# EAGLE design PCB (EAGLE 6.5.0)
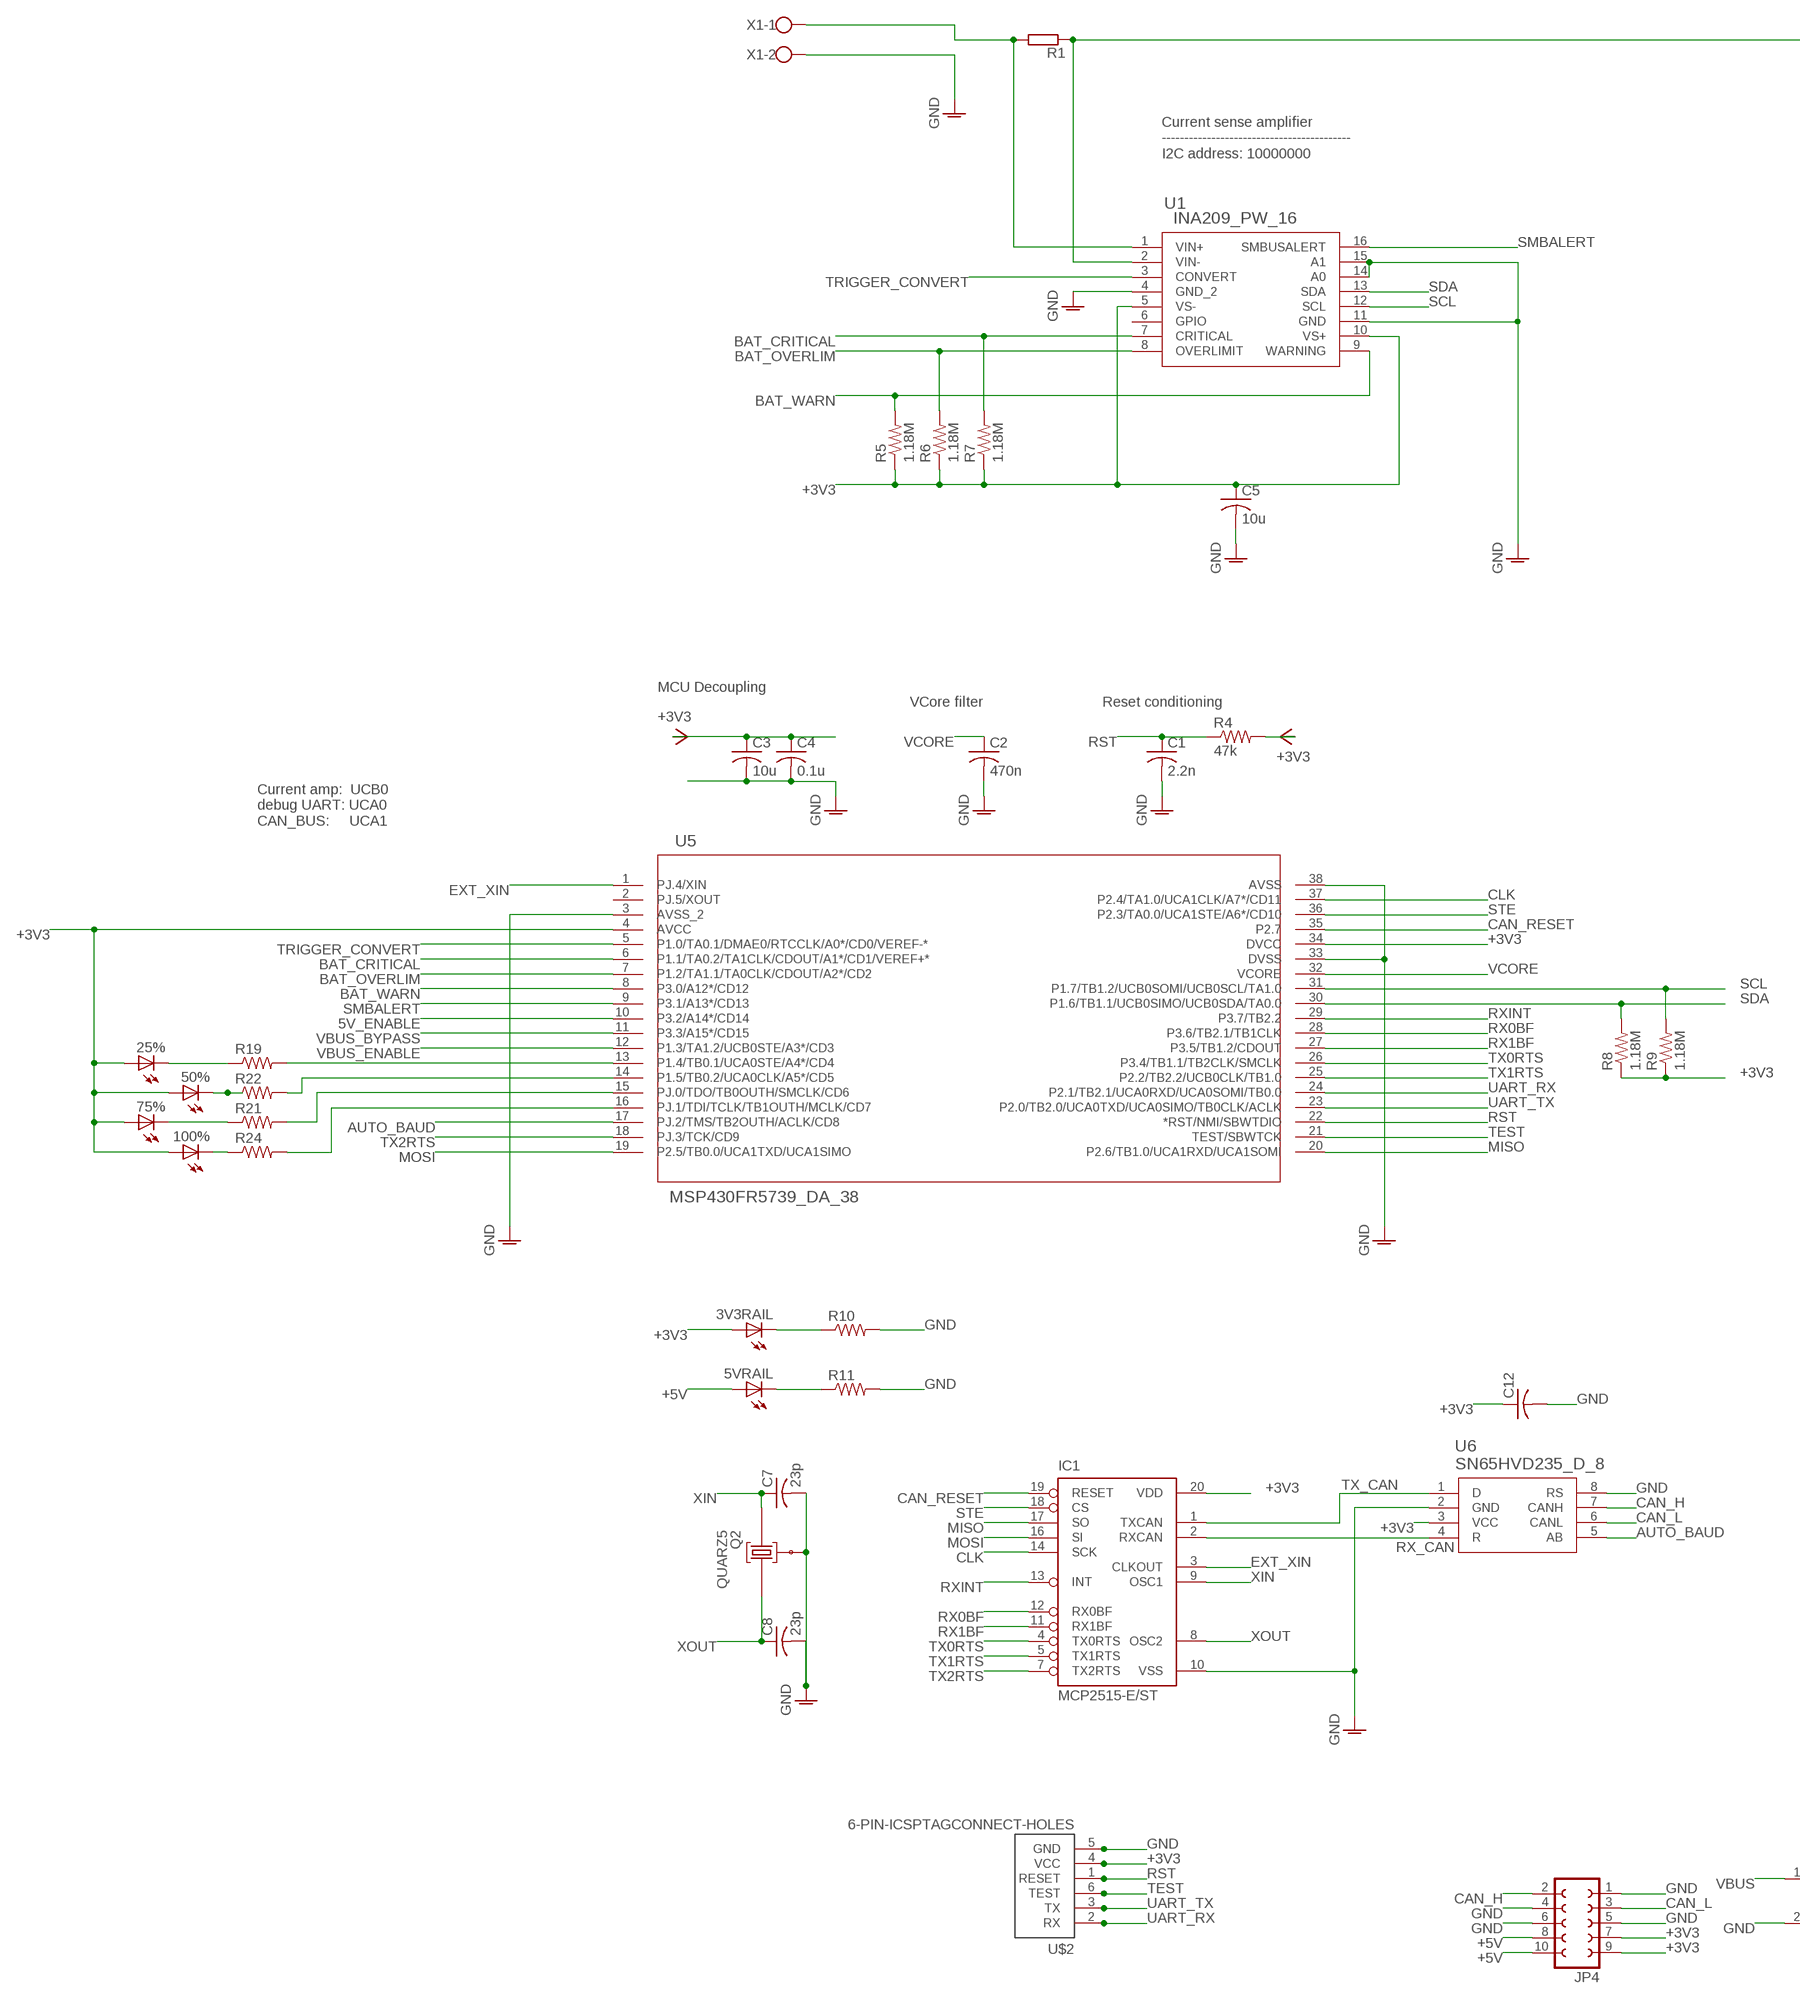
[diagram p0: schematic, sheet 1, part 1 of 2]
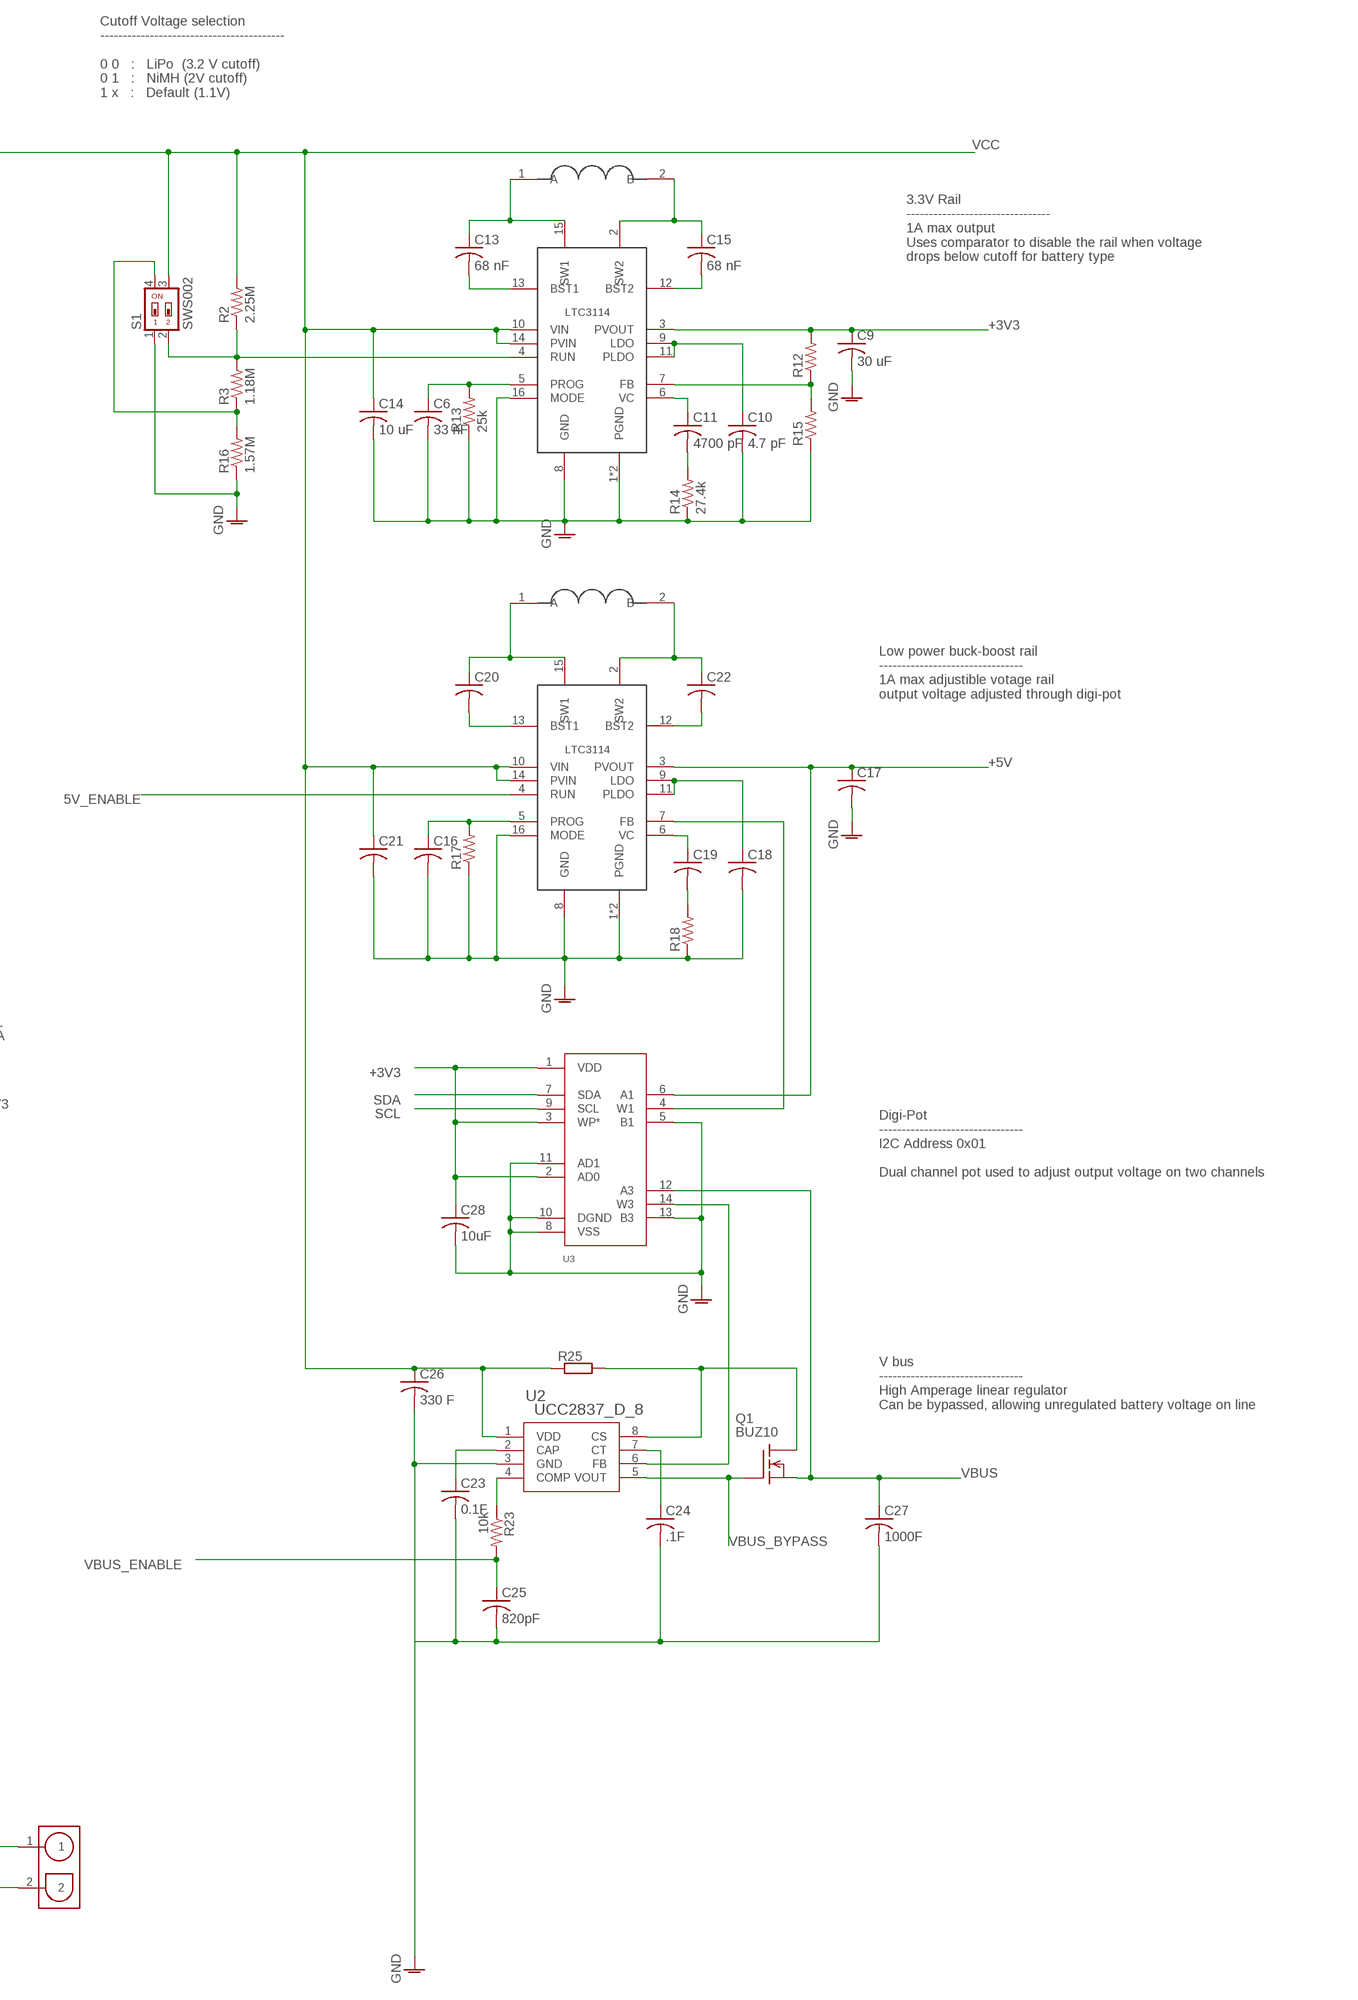
[diagram p1: schematic, sheet 1, part 2 of 2]

## Parts
3V3RAIL  LEDCHIP-LED0603  [CHIP-LED0603]
5VRAIL  LEDCHIP-LED0603  [CHIP-LED0603]
25%  LEDCHIP-LED0603  [CHIP-LED0603]
50%  LEDCHIP-LED0603  [CHIP-LED0603]
75%  LEDCHIP-LED0603  [CHIP-LED0603]
100%  LEDCHIP-LED0603  [CHIP-LED0603]
C1  2.2n  C-USC1206  [C1206]
C2  470n  C-USC1206  [C1206]
C3  10u  C-USC1206  [C1206]
C4  0.1u  C-USC1206  [C1206]
C5  10u  C-USC1206  [C1206]
C6  33 nF  C-USC0805  [C0805]
C7  23p  C-USC1206  [C1206]
C8  23p  C-USC1206  [C1206]
C9  30 uF  C-USC0805  [C0805]
C10  4.7 pF  C-USC0805  [C0805]
C11  4700 pF  C-USC0805  [C0805]
C12  C-USC0603  [C0603]
C13  68 nF  C-USC0805  [C0805]
C14  10 uF  C-USC0805  [C0805]
C15  68 nF  C-USC0805  [C0805]
C16  C-USC0805  [C0805]
C17  C-USC0805  [C0805]
C18  C-USC0805  [C0805]
C19  C-USC0805  [C0805]
C20  C-USC0805  [C0805]
C21  C-USC0805  [C0805]
C22  C-USC0805  [C0805]
C23  0.1F  C-USC0805  [C0805]
C24  .1F  C-USC0805  [C0805]
C25  820pF  C-USC0805  [C0805]
C26  330 F  C-USC0805  [C0805]
C27  1000F  C-USC0805  [C0805]
C28  10uF  C-USC0603  [C0603]
IC1  MCP2515-E/ST  [TSSOP20]
JP4  FE05-2  [FE05-2]
Q1  BUZ10  [TO220]
Q2  QUARZ5  [QUARZ5]
R1  SMR  [SMR]
R2  2.25M  R-US_R0805  [R0805]
R3  1.18M  R-US_R0805  [R0805]
R4  47k  R-US_R1206  [R1206]
R5  1.18M  R-US_R0805  [R0805]
R6  1.18M  R-US_R0805  [R0805]
R7  1.18M  R-US_R0805  [R0805]
R8  1.18M  R-US_R0805  [R0805]
R9  1.18M  R-US_R0805  [R0805]
R10  R-US_R0603  [R0603]
R11  R-US_R0603  [R0603]
R12  R-US_M0805  [M0805]
R13  25k  R-US_M0805  [M0805]
R14  27.4k  R-US_M0805  [M0805]
R15  R-US_M0805  [M0805]
R16  1.57M  R-US_R0805  [R0805]
R17  R-US_M0805  [M0805]
R18  R-US_M0805  [M0805]
R19  R-US_R0603  [R0603]
R21  R-US_R0603  [R0603]
R22  R-US_R0603  [R0603]
R23  10k  R-US_M0805  [M0805]
R24  R-US_R0603  [R0603]
R25  SMR  [SMR]
S1  SWS002  [SMS-002]
U1  INA209_PW_16  [PW16]
U2  UCC2837_D_8  [D8]
U3  AD5252BRU10  [RU_14]
U5  MSP430FR5739_DA_38  [DA38]
U6  SN65HVD235_D_8  [D8]
U$1  LTC3114  [TSSOP-16]
U$2  6-PIN-ICSPTAGCONNECT-HOLES  [TAGCONNECT-HOLES]
U$3  LTC3114  [TSSOP-16]
U$4  DC630R-562M  [DC630]
U$5  DC630R-562M  [DC630]
U$6  MOLEX_15-31-1026  [MOLEX-15-31-1026]
X1  W237-102  [W237-102]

## Nets
5V_ENABLE: U5.10(P3.2/A14*/CD14) U$3.4(RUN)
+3V3: 3V3RAIL.A 25%.A 50%.A 75%.A 100%.A C3.1 C4.1 C5.1 C9.1 C12.1 C28.1 IC1.20(VDD) JP4.7 JP4.9 R4.2 R5.1 R6.1 R7.1 R8.1 R9.1 R12.2 U1.5(VS-) U1.10(VS+) U3.1(VDD) U3.2(AD0) U3.3(WP*) U5.4(AVCC) U5.34(DVCC) U6.3(VCC) U$1.3(PVOUT) U$2.4(VCC)
+5V: 5VRAIL.A C17.1 JP4.8 JP4.10 U3.6(A1) U$3.3(PVOUT)
AUTO_BAUD: U5.17(PJ.2/TMS/TB2OUTH/ACLK/CD8) U6.5(AB)
BAT_CRITICAL: R7.2 U1.7(CRITICAL) U5.6(P1.1/TA0.2/TA1CLK/CDOUT/A1*/CD1/VEREF+*)
BAT_OVERLIM: R6.2 U1.8(OVERLIMIT) U5.7(P1.2/TA1.1/TA0CLK/CDOUT/A2*/CD2)
BAT_WARN: R5.2 U1.9(WARNING) U5.8(P3.0/A12*/CD12)
CAN_H: JP4.2 U6.7(CANH)
CAN_L: JP4.3 U6.6(CANL)
CAN_RESET: IC1.19(RESET) U5.35(P2.7)
CLK: IC1.14(SCK) U5.37(P2.4/TA1.0/UCA1CLK/A7*/CD11)
EXT_XIN: IC1.3(CLKOUT) U5.1(PJ.4/XIN)
GND: C1.2 C2.2 C3.2 C4.2 C5.2 C6.2 C7.2 C8.2 C10.2 C12.2 C14.2 C16.2 C17.2 C18.2 C21.2 C23.2 C24.2 C25.2 C26.2 C27.2 C28.2 IC1.10(VSS) JP4.1 JP4.4 JP4.5 JP4.6 Q2.GND@0 R10.2 R11.2 R13.1 R14.1 R15.1 R16.1 R17.1 R18.1 S1.1 U1.4(GND_2) U1.11(GND) U1.14(A0) U1.15(A1) U2.3(GND) U3.5(B1) U3.8(VSS) U3.10(DGND) U3.11(AD1) U3.13(B3) U5.3(AVSS_2) U6.2(GND) U6.8(RS) U$1.1(PGND) U$1.8(GND) U$1.16(MODE) U$1.PAD(PGND) U$2.5(GND) U$3.1(PGND) U$3.8(GND) U$3.16(MODE) U$3.PAD(PGND) U$6.2 X1.2
GNDA: C9.2 U5.33(DVSS) U5.38(AVSS) ; supply symbol labelled GND
MISO: IC1.17(SO) U5.20(P2.6/TB1.0/UCA1RXD/UCA1SOMI)
MOSI: IC1.16(SI) U5.19(P2.5/TB0.0/UCA1TXD/UCA1SIMO)
N$1: 25%.C R19.1
N$2: R3.1 R16.2 S1.4
N$3: R19.2 U5.13(P1.4/TB0.1/UCA0STE/A4*/CD4)
N$4: 5VRAIL.C R11.1
N$5: 3V3RAIL.C R10.1
N$6: C13.1 U$1.15(SW1) U$4.1(A)
N$7: C15.1 U$1.2(SW2) U$4.2(B)
N$8: C13.2 U$1.13(BST1)
N$9: C15.2 U$1.12(BST2)
N$10: C20.1 U$3.15(SW1) U$5.1(A)
N$11: C6.1 R13.2 U$1.5(PROG)
N$12: C22.1 U$3.2(SW2) U$5.2(B)
N$13: C10.1 U$1.9(LDO) U$1.11(PLDO)
N$14: C20.2 U$3.13(BST1)
N$15: C11.1 U$1.6(VC)
N$16: C11.2 R14.2
N$17: R12.1 R15.2 U$1.7(FB)
N$18: C22.2 U$3.12(BST2)
N$19: C16.1 R17.2 U$3.5(PROG)
N$20: C18.1 U$3.9(LDO) U$3.11(PLDO)
N$21: R2.1 R3.2 S1.2 U$1.4(RUN)
N$22: C19.1 U$3.6(VC)
N$23: C19.2 R18.2
N$24: U3.4(W1) U$3.7(FB)
N$25: Q1.2(D) R25.1 U2.8(CS)
N$26: R22.2 U5.14(P1.5/TB0.2/UCA0CLK/A5*/CD5)
N$27: C23.1 U2.2(CAP)
N$28: U2.6(FB) U3.14(W3)
N$29: R23.1 U2.4(COMP)
N$30: R21.2 U5.15(PJ.0/TDO/TB0OUTH/SMCLK/CD6)
N$31: R24.2 U5.16(PJ.1/TDI/TCLK/TB1OUTH/MCLK/CD7)
N$32: C24.1 U2.7(CT)
N$33: 50%.C R22.1
N$34: 75%.C R21.1
N$35: 100%.C R24.1
RST: C1.1 R4.1 U5.22(*RST/NMI/SBWTDIO) U$2.1(RESET)
RX0BF: IC1.12(RX0BF) U5.28(P3.6/TB2.1/TB1CLK)
RX1BF: IC1.11(RX1BF) U5.27(P3.5/TB1.2/CDOUT)
RX_CAN: IC1.2(RXCAN) U6.4(R)
RXINT: IC1.13(INT) U5.29(P3.7/TB2.2)
SCL: R9.2 U1.12(SCL) U3.9(SCL) U5.31(P1.7/TB1.2/UCB0SOMI/UCB0SCL/TA1.0)
SDA: R8.2 U1.13(SDA) U3.7(SDA) U5.30(P1.6/TB1.1/UCB0SIMO/UCB0SDA/TA0.0)
SMBALERT: U1.16(SMBUSALERT) U5.9(P3.1/A13*/CD13)
STE: IC1.18(CS) U5.36(P2.3/TA0.0/UCA1STE/A6*/CD10)
TEST: U5.21(TEST/SBWTCK) U$2.6(TEST)
TRIGGER_CONVERT: U1.3(CONVERT) U5.5(P1.0/TA0.1/DMAE0/RTCCLK/A0*/CD0/VEREF-*)
TX0RTS: IC1.4(TX0RTS) U5.26(P3.4/TB1.1/TB2CLK/SMCLK)
TX1RTS: IC1.5(TX1RTS) U5.25(P2.2/TB2.2/UCB0CLK/TB1.0)
TX2RTS: IC1.7(TX2RTS) U5.18(PJ.3/TCK/CD9)
TX_CAN: IC1.1(TXCAN) U6.1(D)
UART_RX: U5.24(P2.1/TB2.1/UCA0RXD/UCA0SOMI/TB0.0) U$2.2(RX)
UART_TX: U5.23(P2.0/TB2.0/UCA0TXD/UCA0SIMO/TB0CLK/ACLK) U$2.3(TX)
VBUS: C27.1 Q1.3(S) U3.12(A3) U$6.1
VBUS_BYPASS: Q1.1(G) U2.5(VOUT) U5.11(P3.3/A15*/CD15)
VBUS_ENABLE: C25.1 R23.2 U5.12(P1.3/TA1.2/UCB0STE/A3*/CD3)
VCC: C14.1 C21.1 C26.1 R1.2 R2.2 R25.2 S1.3 U1.2(VIN-) U2.1(VDD) U$1.10(VIN) U$1.14(PVIN) U$3.10(VIN) U$3.14(PVIN)
VCC_1: R1.1 U1.1(VIN+) X1.1
VCORE: C2.1 U5.32(VCORE)
XIN: C7.1 IC1.9(OSC1) Q2.2
XOUT: C8.1 IC1.8(OSC2) Q2.1
Unconnected: U1.6(GPIO) U5.2(PJ.5/XOUT)

## Notes on the sheet
- Cutoff Voltage selection
  -----------------------------------------
  
  0 0   :   LiPo  (3.2 V cutoff)
  0 1   :   NiMH (2V cutoff)
  1 x   :   Default (1.1V)
- Current sense amplifier
  ------------------------------------------
  I2C address: 10000000
- 3.3V Rail
  --------------------------------
  1A max output
  Uses comparator to disable the rail when voltage
  drops below cutoff for battery type
- Low power buck-boost rail
  --------------------------------
  1A max adjustible votage rail
  output voltage adjusted through digi-pot
- MCU Decoupling
- VCore filter | Reset conditioning
- Current amp:  UCB0
  debug UART: UCA0
  CAN_BUS:     UCA1
- Digi-Pot
  --------------------------------
  I2C Address 0x01
  
  Dual channel pot used to adjust output voltage on two channels
- V bus
  --------------------------------
  High Amperage linear regulator
  Can be bypassed, allowing unregulated battery voltage on line

## Library data of the parts
3V3RAIL 5VRAIL 25% 50% 75% 100% = adafruit:LED: LED OSRAM: - CHIPLED LG R971, LG N971, LY N971, LG Q971, LY Q971, LO R971, LY R971 LH N974, LH R974 LS Q976, LO Q976, LY Q976 LO Q996 - Hyper CHIPLED LW Q18S LB Q993, LB Q99A, LB R99A - SideLED LS A670, LO A670, LY A670, LG A670, LP A670 LB A673, LV A673, LT A673, LW A673 LH A674 LY A675 LS A676, LA A676, LO A676, LY A676, LW A676 LS A679, LY A679, LG A679 - Hyper Micro SIDELED® LS Y876, LA Y876, LO Y876, LY Y876 LT Y87S - SmartLED LW L88C, LW L88S LB L89C, LB L89S, LG L890 LS L89K, LO L89K, LY L89K LS L896, LA L896, LO L896, LY L896 - TOPLED LS T670, LO T670, LY T670, LG T670, LP T670 LSG T670, LSP T670, LSY T670, LOP T670, LYG T670 LG T671, LOG T671, LSG T671 LB T673, LV T673, LT T673, LW T673 LH T674 LS T676, LA T676, LO T676, LY T676, LB T676, LH T676, LSB T676, LW T676 LB T67C, LV T67C, LT T67C, LS T67K, LO T67K, LY T67K, LW E67C LS E67B, LA E67B, LO E67B, LY E67B, LB E67C, LV E67C, LT E67C LW T67C LS T679, LY T679, LG T679 LS T770, LO T770, LY T770, LG T770, LP T770 LB T773, LV T773, LT T773, LW T773 LH T774 LS E675, LA E675, LY E675, LS T675 LS T776, LA T776, LO T776, LY T776, LB T776 LHGB T686 LT T68C, LB T68C - Hyper Mini TOPLED® LB M676 - Mini TOPLED Santana® LG M470 LS M47K, LO M47K, LY M47K Source: http://www.osram.convergy.de/
C1-C28 = adafruit:C-US: CAPACITOR, American symbol
IC1 = mcp2515:MCP2515
JP4 = con-lsta:FE05-2: FEMALE HEADER; OC_FARNELL: unknown; OC_NEWARK: unknown
Q1 = transistor-fet:BUZ10: N-Channel Enhancement MOSFET 50V; 20A; 0,080Ohm
Q2 = sMSP430:QUARZ5
R1 R25 = resistor-shunt:SMR: SMD SHUNT RESISTOR; OC_FARNELL: unknown; OC_NEWARK: unknown
R2-R19 R21-R24 = adafruit:R-US_: RESISTOR, American symbol
S1 = smd-special:SWS002: SMD Dip Switch 2 pol.
U1 = TexasInstruments:INA209_PW_16; DATASHEETURL: http://www.ti.com/lit/gpn/INA209; DESCRIPTION: High-Side Measurement, Bi-Directional Current/Power Monitor with I2C Interface; FAMILY_NAME: CURRENT SHUNT MONITOR; GENERIC_PART_NUMBER: INA209; INDUSTRY_STD_PKG_TYPE: TSSOP; MANUFACTURER: Texas Instruments; MANUFACTURER_PART_NUMBER: ina209_pw_16; PACKAGE_DESIGNATOR: PW; PIN_COUNT: 16; VENDOR: Texas Instruments
U2 = TexasInstruments:UCC2837_D_8; DATASHEETURL: http://www.ti.com/lit/gpn/UCC2837; DESCRIPTION: 8-Pin N-FET Linear Regulator Controller; FAMILY_NAME: LDO CONTROLLER; GENERIC_PART_NUMBER: UCC2837; INDUSTRY_STD_PKG_TYPE: SOIC; MANUFACTURER: Texas Instruments; MANUFACTURER_PART_NUMBER: ucc2837_d_8; PACKAGE_DESIGNATOR: D; PIN_COUNT: 8; VENDOR: Texas Instruments
U3 = linear:AD5252BRU10; MANUFACTURER_PART_NUMBER: AD5252BRU10; VENDOR: Vendor
U5 = TexasInstruments:MSP430FR5739_DA_38; DATASHEETURL: http://www.ti.com/lit/gpn/MSP430FR5739; DESCRIPTION: MSP430FR573x,MSP430FR572x Mixed Signal Microcontroller; FAMILY_NAME: FRAM Series; GENERIC_PART_NUMBER: MSP430FR5739; INDUSTRY_STD_PKG_TYPE: TSSOP; MANUFACTURER: Texas Instruments; MANUFACTURER_PART_NUMBER: msp430fr5739_da_38; PACKAGE_DESIGNATOR: DA; PIN_COUNT: 38; VENDOR: Texas Instruments
U6 = TexasInstruments:SN65HVD235_D_8; DATASHEETURL: http://www.ti.com/lit/gpn/SN65HVD235; DESCRIPTION: 3.3V CAN with Standby Mode, Autobaud Loop-back; FAMILY_NAME: CAN; GENERIC_PART_NUMBER: SN65HVD235; INDUSTRY_STD_PKG_TYPE: SOIC; MANUFACTURER: Texas Instruments; MANUFACTURER_PART_NUMBER: sn65hvd235_d_8; PACKAGE_DESIGNATOR: D; PIN_COUNT: 8; VENDOR: Texas Instruments
U$1 U$3 = linear:LTC3114
U$2 = LaunchFET:6-PIN-ICSP: 6 pin easy-msp formatted headers. Designed to make programming target boards with MSP430 Launchpad easier. EASYMSP: standard .05" pitch header to match launchpad SAFEMSP: .05" header with .025" offset Vcc to keep Geordi away
U$4 U$5 = connectors:DC630R-562M
U$6 = connectors:MOLEX_15-31-1026
X1 = con-wago-500:W237-102: WAGO SCREW CLAMP; MPN: 237-102; OC_FARNELL: unknown; OC_NEWARK: 70K9898

## Board
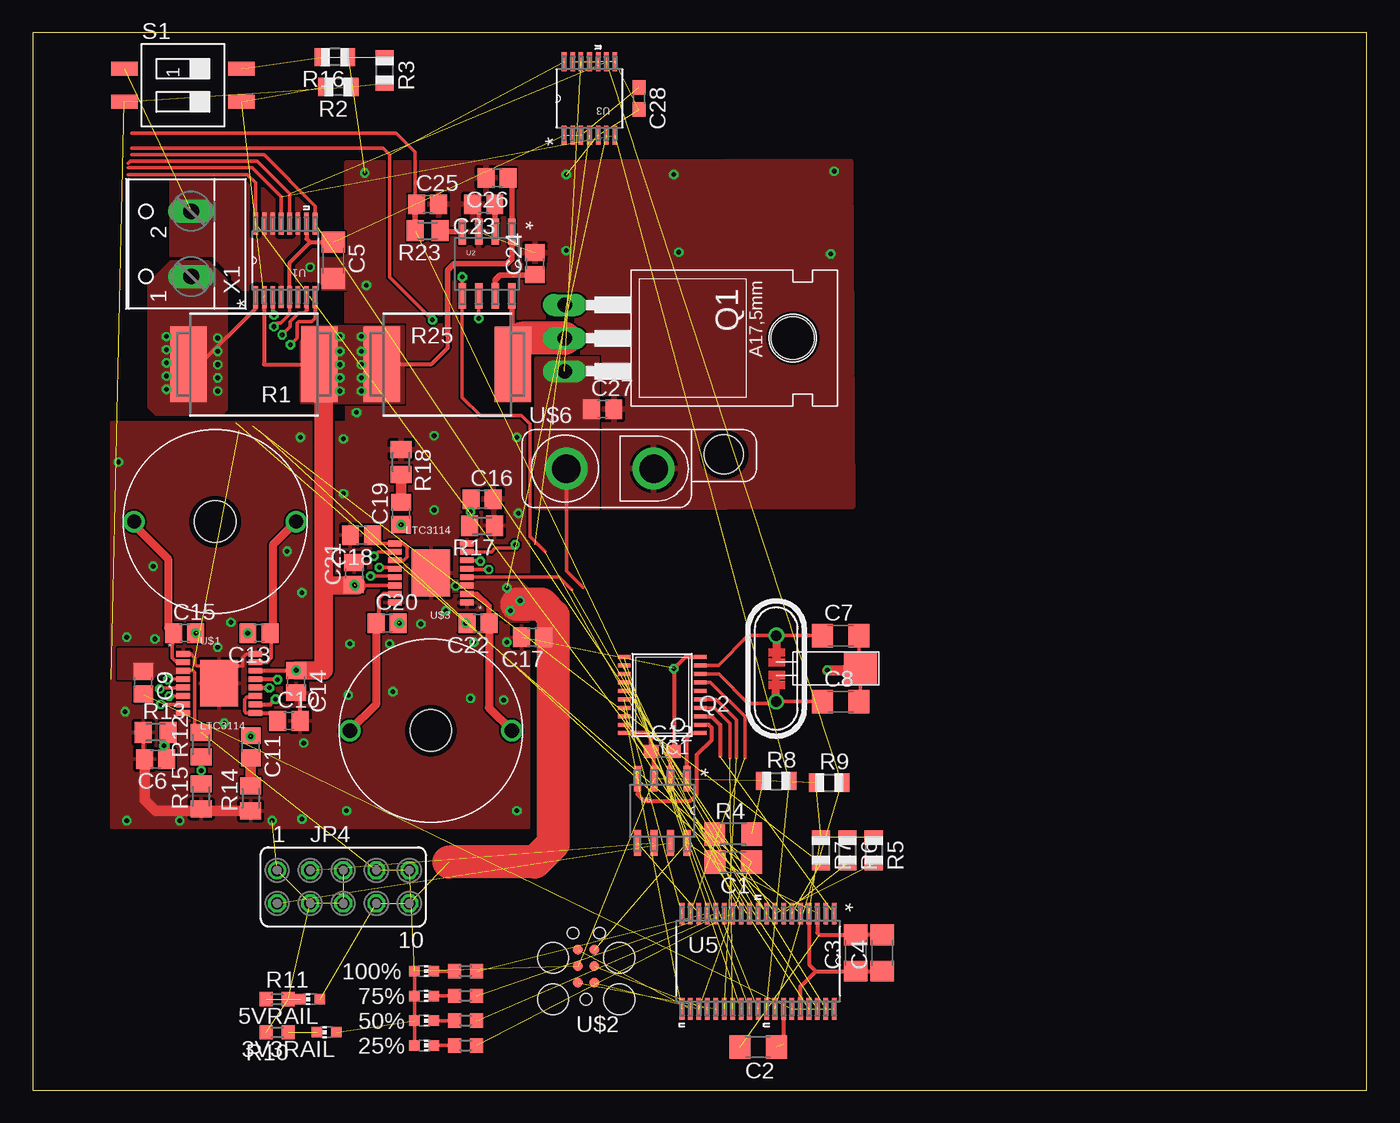
[diagram p2: board, top side]
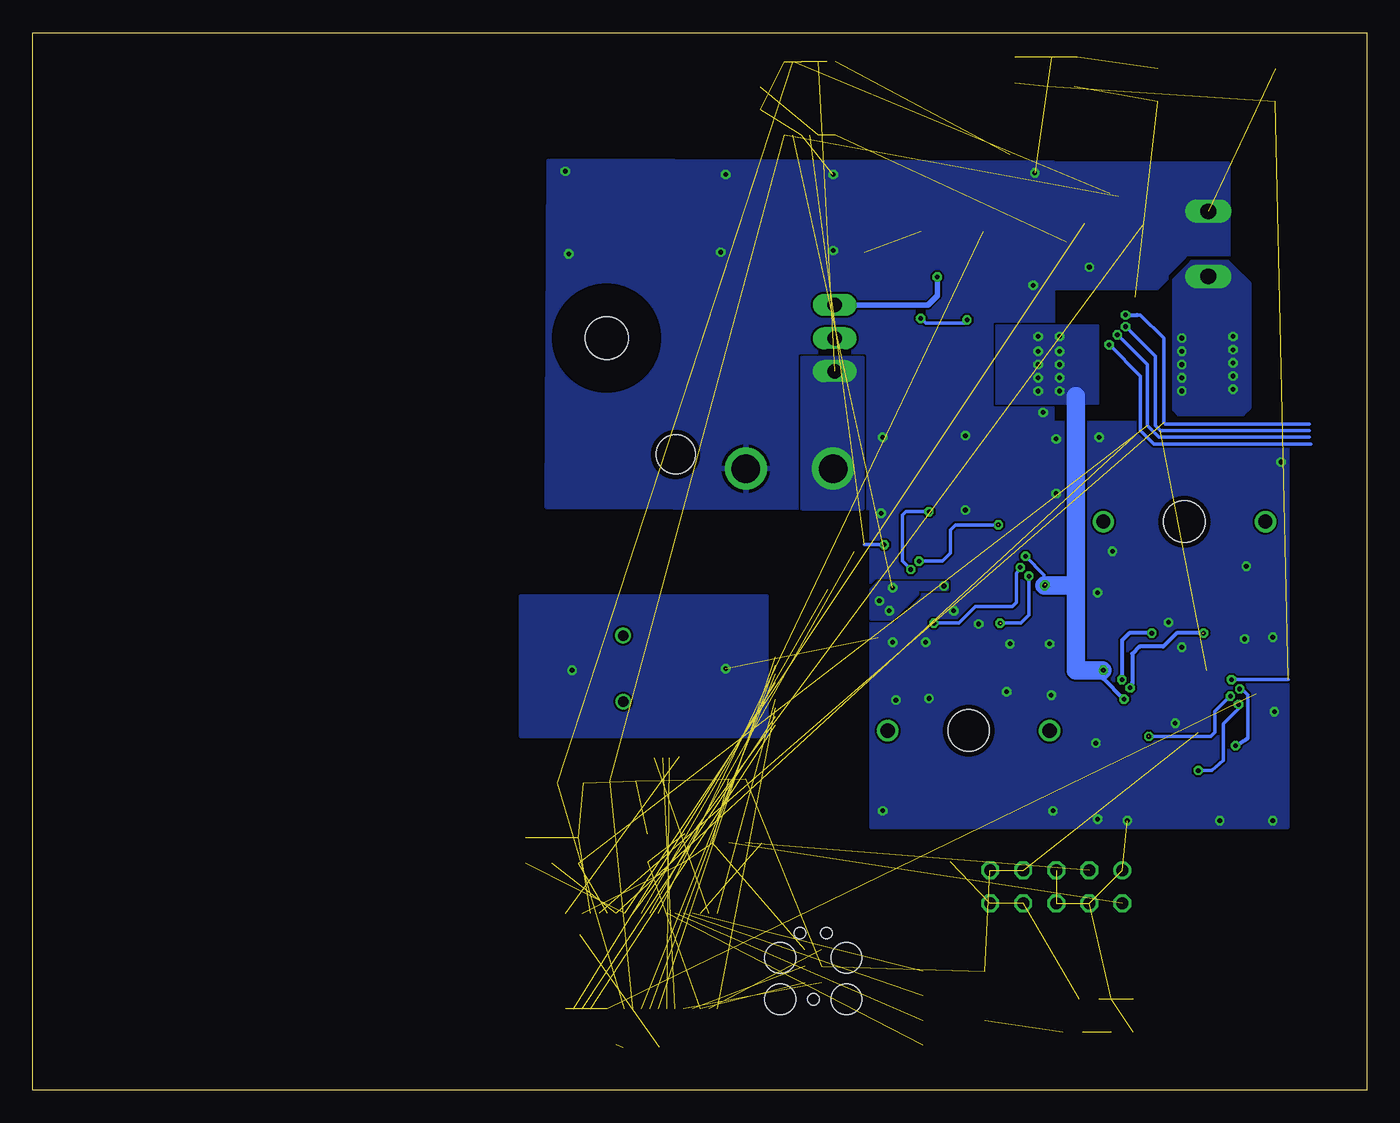
[diagram p3: board, bottom side, seen from below]

Size 102.54 x 81.27 mm. Coordinates in mm from the lower left corner, seen from the top.
Outline: 0,0 102.54,0 102.54,81.27 0,81.27 0,0
Copper layers (1*16): Top 0.0356mm / dielectric 1.5011mm / Bottom 0.0356mm
Design rules "oshpark": minimum track width 6mil, minimum drill 13mil, track to track 6mil, track to pad 6mil, pad to pad 6mil, via to via 6mil, smd to smd 6mil, copper to edge 15mil, drill to drill 6mil, minimum pad ring 7mil, minimum via ring 7mil, stop-mask expansion 4mil, vias tented up to drill 0mil, thermal gap 10mil

### Footprints (pad centres in the part's own frame; a part is rotated, then mirrored left to right if it is on the bottom)
CHIP-LED0603 = smd 0.8 x 0.8: A 0,-0.75; C 0,0.75
C1206 = smd 1.6 x 1.8: 1 -1.4,0; 2 1.4,0
C0805 = smd 1.3 x 1.5: 1 -0.85,0; 2 0.85,0
C0603 = smd 1.1 x 1: 1 -0.85,0; 2 0.85,0
TSSOP20 = smd 0.305 x 0.991: 1 -2.925,-2.918; 2 -2.275,-2.918; 3 -1.625,-2.918; 4 -0.975,-2.918; 5 -0.325,-2.918; 6 0.325,-2.918; 7 0.975,-2.918; 8 1.625,-2.918; 9 2.275,-2.918; 10 2.925,-2.918; 11 2.925,2.918; 12 2.275,2.918; 13 1.625,2.918; 14 0.975,2.918; 15 0.325,2.918; 16 -0.325,2.918; 17 -0.975,2.918; 18 -1.625,2.918; 19 -2.275,2.918; 20 -2.925,2.918
FE05-2 = drill 0.914: 1 -5.08,1.27 | drill 0.914 octagon: 2 -5.08,-1.27; 3 -2.54,1.27; 4 -2.54,-1.27; 5 0,1.27; 6 0,-1.27; 7 2.54,1.27; 8 2.54,-1.27; 9 5.08,1.27; 10 5.08,-1.27
TO220 = drill 1.118 long: 1 -2.54,-6.35; 2 0,-6.35; 3 2.54,-6.35 | hole 3.302: 0,11.176
QUARZ5 = drill 0.813: 1 1.53,1.773; 2 1.52,-3.303 | smd 2.54 x 2.54: GND@0 -4.941,-0.762
SMR = smd 2.8 x 5.8: 1 5.029,0; 2 -5.029,0
R0805 = smd 1.1 x 1.4: 1 -1,0; 2 1,0
R1206 = smd 1.6 x 1.803: 1 -1.422,0; 2 1.422,0
R0603 = smd 1 x 1.1: 1 -0.85,0; 2 0.85,0
M0805 = smd 1.3 x 1.6: 1 -0.95,0; 2 0.95,0
SMS-002 = smd 1.092 x 2.007: 1 -1.27,-4.496; 2 1.27,-4.496; 3 1.27,4.496; 4 -1.27,4.496
PW16 = smd 1.676 x 0.356: 1 -2.819,2.286; 2 -2.819,1.626; 3 -2.819,0.965; 4 -2.819,0.33; 5 -2.819,-0.33; 6 -2.819,-0.965; 7 -2.819,-1.626; 8 -2.819,-2.286; 9 2.819,-2.286; 10 2.819,-1.626; 11 2.819,-0.965; 12 2.819,-0.33; 13 2.819,0.33; 14 2.819,0.965; 15 2.819,1.626; 16 2.819,2.286
D8 = smd 1.981 x 0.559: 1 -2.464,1.905; 2 -2.464,0.635; 3 -2.464,-0.635; 4 -2.464,-1.905; 5 2.464,-1.905; 6 2.464,-0.635; 7 2.464,0.635; 8 2.464,1.905
RU_14 = smd 1.473 x 0.356: 1 -2.819,1.956; 2 -2.819,1.295; 3 -2.819,0.66; 4 -2.819,0; 5 -2.819,-0.66; 6 -2.819,-1.295; 7 -2.819,-1.956; 8 2.819,-1.956; 9 2.819,-1.295; 10 2.819,-0.66; 11 2.819,0; 12 2.819,0.66; 13 2.819,1.295; 14 2.819,1.956
DA38 = smd 1.676 x 0.356: 1 -3.658,5.842; 2 -3.658,5.207; 3 -3.658,4.547; 4 -3.658,3.912; 5 -3.658,3.251; 6 -3.658,2.591; 7 -3.658,1.956; 8 -3.658,1.295; 9 -3.658,0.66; 10 -3.658,0; 11 -3.658,-0.66; 12 -3.658,-1.295; 13 -3.658,-1.956; 14 -3.658,-2.591; 15 -3.658,-3.251; 16 -3.658,-3.912; 17 -3.658,-4.547; 18 -3.658,-5.207; 19 -3.658,-5.842; 20 3.658,-5.842; 21 3.658,-5.207; 22 3.658,-4.547; 23 3.658,-3.912; 24 3.658,-3.251; 25 3.658,-2.591; 26 3.658,-1.956; 27 3.658,-1.295; 28 3.658,-0.66; 29 3.658,0; 30 3.658,0.66; 31 3.658,1.295; 32 3.658,1.956; 33 3.658,2.591; 34 3.658,3.251; 35 3.658,3.912; 36 3.658,4.547; 37 3.658,5.207; 38 3.658,5.842
TSSOP-16 = smd 0.45 x 1.05: 1 0,0.525; 2 0.65,0.525; 3 1.3,0.525; 4 1.95,0.525; 5 2.6,0.525; 6 3.25,0.525; 7 3.9,0.525; 8 4.55,0.525; 9 4.55,6.075; 10 3.9,6.075; 11 3.25,6.075; 12 2.6,6.075; 13 1.95,6.075; 14 1.3,6.075; 15 0.65,6.075; 16 0,6.075 | smd 3.58 x 2.94: PAD 2.275,3.3
TAGCONNECT-HOLES = smd 0.787 x 0.787: 1 -1.27,-0.635; 2 -1.27,0.635; 3 0,-0.635; 4 0,0.635; 5 1.27,-0.635; 6 1.27,0.635 | hole 0.889: -2.54,0; 2.54,-1.016; 2.54,1.016 | hole 2.375: -2.54,2.54; -2.54,-2.54; 0.635,-2.54; 0.635,2.54
DC630 = drill 1.1: 1 0,-6.35; 2 0,6.096 | hole 3.2: 0,-0.127
MOLEX-15-31-1026 = drill 2.2: 1 -6.6,0; 2 0.1,0 | hole 3: 5.5,1.1
W237-102 = drill 1.194 long: 1 -2.5,-1.27; 2 2.5,-1.27

### Placement (x,y rotation side)
3V3RAIL  22.61,4.45 90 top
5VRAIL  21.34,6.99 90 top
25%  30.1,3.43 270 top
50%  30.1,5.33 270 top
75%  30.1,7.24 270 top
100%  30.1,9.14 270 top
C1  53.85,17.53 180 top
C2  55.75,3.3 180 top
C3  63.25,10.54 90 top
C4  65.28,10.54 90 top
C5  23.11,63.75 270 top
C6  9.46,25.43 180 top
C7  62.1,34.92 0 top
C8  62.1,29.84 0 top
C9  8.51,31.31 270 top
C10  19.7,28.37 0 top
C11  16.76,26.38 270 top
C12  48.39,26.04 0 top
C13  17.4,35.12 180 top
C14  20.26,31.38 270 top
C15  11.68,35.12 0 top
C16  34.54,45.4 0 top
C17  38.42,34.8 180 top
C18  25.27,42.64 180 top
C19  28.32,44.32 90 top
C20  27.24,35.88 0 top
C21  24.7,39.69 90 top
C22  34.23,35.88 180 top
C23  34.67,68.07 180 top
C24  38.61,63.5 90 top
C25  30.35,68.07 0 top
C26  35.69,70.1 180 top
C27  43.81,52.32 0 top
C28  46.61,76.2 270 top
IC1  48.39,30.35 90 top
JP4  23.88,15.62 0 top
Q1  47.24,57.78 270 top
Q2  58.67,31.62 180 top
R1  17.02,55.75 180 top
R2  23.5,77.09 180 top
R3  27.05,78.36 270 top
R4  53.85,19.68 0 top
R5  64.64,18.41 270 top
R6  62.61,18.41 270 top
R7  60.58,18.41 270 top
R8  57.15,23.75 0 top
R9  61.21,23.62 0 top
R10  18.8,4.45 180 top
R11  18.8,6.99 0 top
R12  12.95,26.54 90 top
R13  9.46,27.5 0 top
R14  16.76,22.42 90 top
R15  12.95,22.57 90 top
R16  23.24,79.38 180 top
R17  34.54,43.37 180 top
R18  28.32,48.26 270 top
R19  33.27,3.43 0 top
R21  33.27,7.24 0 top
R22  33.27,5.33 0 top
R23  30.35,66.04 180 top
R24  33.27,9.14 0 top
R25  31.88,55.75 0 top
S1  11.56,77.22 270 top
U1  19.43,63.75 90 top
U2  34.92,63.5 270 top
U3  42.8,76.2 90 top
U5  55.75,9.91 270 top
U6  48.39,21.46 270 top
U$1  11.05,33.53 270 top
U$2  42.55,9.53 90 top
U$3  33.91,37.47 90 top
U$4  13.91,43.69 90 top
U$5  30.73,27.62 270 top
U$6  47.62,47.75 0 top
X1  10.92,65.02 90 top

### Tracks (layer width: path | path; a pad name or v marks a point on that pad's centre or on a via)
5V_ENABLE  (1 unrouted)
  Top 0.254: U$3.4 40.47,39.41 41.4,38.48
+3V3  (via drill 0.36)  (18 unrouted)
  Top 0.254: 100%.A 75%.A 50%.A 25%.A | 8.58,32.23 C9.1 | 12.48,27.97 12.48,32.1 12.32,32.26 11.6,32.26 U$1.3 | U1.5 19.76,59.64 19.05,58.93 18.8,58.93 v18.54,58.67
  Top 0.305: R12.2 12.48,27.97 | U1.10 21.06,65.43 21.34,65.15 | 21.34,65.15 C5.1 | U1.5 19.76,63.58 21.34,65.15 | U5.4 59.66,9.68 60.2,9.14 | 60.2,9.14 C3.1 C4.1 | U5.34 59,7.95 60.2,9.14 | U6.3 47.75,25.82 C12.1 47.54,27.01 47.12,27.43 IC1.20
  Bottom 0.254: v18.54,58.67 16.26,56.39 16.26,51.05 15.88,50.67 4.45,50.67
  pour Top (no thermals): 12,32.58 12,31.94 9.46,31.94 9.14,31.62 6.6,31.62 6.6,33.85 10.73,33.85 11.05,32.58
+5V  (via drill 0.36)  (4 unrouted)
  Top 0.254: 40.01,36.45 40.01,35.53 C17.1
  Top 0.406: 33.35,38.73 U$3.3
  Top 2.54: 37.21,37.34 39.12,37.34 40.01,36.45 40.01,18.92 38.61,17.53 32,17.53
  other vias: 36.7,36.83 36.45,38.61 32.51,38.73 37.47,37.59
  pour Top (rank 2): 35.69,39.37 37.97,36.2 36.7,36.2
  pour Bottom: 32.26,38.48 34.54,38.48 34.54,38.1 36.45,36.2 38.1,36.2 38.1,38.48 37.59,38.99 32.26,38.99
  pour Top (no thermals): 32.13,39.12 37.47,39.12 38.1,38.48 38.1,36.07 36.45,36.07 34.16,38.35 32.13,38.35
AUTO_BAUD  (1 unrouted)
BAT_CRITICAL  (via drill 0.36)  (2 unrouted)
  Top 0.254: v19.18,58.04 19.81,58.67 19.81,59.05 20.45,59.69 20.83,59.69 21.06,59.92
  Top 0.305: U1.7 21.06,59.92
  Bottom 0.254: v19.18,58.04 16.89,55.75 16.89,51.05 16,50.16 4.45,50.16
BAT_OVERLIM  (via drill 0.36)  (2 unrouted)
  Top 0.254: 21.72,59.69 21.72,59.31 21.46,59.05 20.45,59.05 20.32,58.93 20.32,57.78 v19.81,57.28
  Top 0.305: U1.8 21.72,59.69
  Bottom 0.254: v19.81,57.28 17.4,54.86 17.4,50.67 16.38,49.66 4.32,49.66
BAT_WARN  (2 unrouted)
  Top 0.254: U1.9 21.72,67.94 17.78,71.88 7.62,71.88
CAN_H  (1 unrouted)
CAN_L  (1 unrouted)
CAN_RESET  (1 unrouted)
CLK  (1 unrouted)
EXT_XIN  (1 unrouted)
  Top 0.305: IC1.3 52.17,28.73 52.83,28.07 52.83,25.65
GND  (via drill 0.36)  (21 unrouted)
  Top 0.254: U$1.16 16.45,33.53 16.13,33.21 16.13,32.58 15.81,32.58 | U$1.1 12.16,33.53 12.48,33.21 12.48,32.73 12.64,32.58 12.95,32.58 | R13.1 8.51,25.53 C6.2 | C7.2 63.5,32.5 Q2.GND@0 63.62,29.96 C8.2 | U2.3 34.29,67.6 C23.2
  Top 0.305: C10.2 20.55,30.16 C14.2 | C4.2 C3.2 60.45,11.94 60.3,12.09 U5.3 | U6.2 49.02,25.82 C12.2 49.28,26.07 v49.28,32.38 50.16,33.27 IC1.10
  Top 0.813: C6.2 8.61,22.31 9.46,21.46 12.79,21.46 R15.1 13.11,21.46 R14.1 | v61.09,32.26 63.49,32.26 Q2.GND@0
  other vias: 6.6,48.26 20.57,50.16 20.7,38.23 9.27,40.26 19.56,41.4 7.24,34.8 9.4,34.67 15.24,35.94 14.22,34.04 14.73,28.19 20.83,26.67 20.7,20.83 18.41,20.7 11.3,20.7 11.3,20.7 7.24,20.7 7.11,29.08 25.53,70.48 25.65,61.85 24.89,52.07 61.59,70.61 49.28,70.36 41.02,70.36 61.34,64.26 49.66,64.39 41.02,64.52 21.34,63.25 24.13,21.46 37.21,21.46 36.2,29.97 36.45,34.42 33.91,34.42 33.66,30.1 29.84,35.81 31.75,36.83 27.43,34.29 24.38,34.29 24.26,30.35 27.69,30.61 23.88,50.04 23.88,45.85 30.86,50.29 37.21,50.16 37.34,44.32 30.86,44.58
  pour Bottom (isolate 0.305, rank 2, no thermals): 10.67,64.01 13.72,64.01 16.13,61.59 24.13,61.59 24.13,71.25 10.67,71.25
  pour Top (isolate 0.305, rank 2, no thermals): 10.67,64.01 13.72,64.01 16.13,61.59 24.13,61.59 24.13,71.25 10.67,71.25
  pour Bottom (rank 2): 38.1,51.31 38.1,20.19 6.1,20.19 6.1,51.31
  pour Bottom (rank 2): 62.87,71.37 24.13,71.25 24.26,44.7 62.99,44.83
  pour Top (rank 2): 62.87,71.37 24.13,71.25 24.26,44.7 62.99,44.83
  pour Top (rank 2): 38.1,51.31 38.1,20.19 6.1,20.19 6.1,51.31
  pour Bottom: 46.1,27.18 65.02,27.18 65.02,37.97 46.1,37.97
GNDA  (2 unrouted)
MISO  (1 unrouted)
MOSI  (1 unrouted)
N$1
  Top 0.254: 25%.C R19.1
N$2  (2 unrouted)
N$3  (1 unrouted)
N$4  (1 unrouted)
N$5  (1 unrouted)
N$6
  Top 0.254: U$1.15 18.02,32.88 18.35,33.21 18.35,35.01 C13.1
  Top 0.61: U$4.1 18.45,41.89 18.45,35.32 C13.1
N$7
  Top 0.254: U$1.2 11.06,32.88 10.73,33.21 10.73,34.06 C15.1
  Top 0.61: U$4.2 7.81,43.43 10.41,40.83 10.41,35.53 C15.1
N$8  (via drill 0.36)  (1 unrouted)
  Top 0.305: U$1.13 18.79,31.58 v18.83,31.54
  Bottom 0.305: v16.53,35.12 18.27,35.12 18.83,34.56 v18.83,31.54
N$9  (via drill 0.36)  (2 unrouted)
  Top 0.305: U$1.12 18.02,30.93 v18.19,30.91
  Bottom 0.305: 12.64,35.12 14.62,35.12 15.65,34.08 17.48,34.08 18.03,33.53 18.03,31.3 v18.19,30.91
  other vias: 12.56,35.12
N$10
  Top 0.305: U$3.15 26.94,38.12 26.61,37.78 26.61,36.09 C20.1
  Top 0.61: C20.1 26.39,29.63 U$5.1
N$11  (via drill 0.36)
  Top 0.254: R13.2 10.41,26.23 | 10.41,26.23 10.41,25.53 C6.1 | U$1.5 10.99,30.93 10.97,30.91 9.86,30.91 v9.78,30.83 | v10.1,26.46 10.25,26.38 10.41,26.23
  Bottom 0.254: v9.78,30.83 9.62,30.83 9.14,30.35 9.14,27.02 v10.1,26.46
N$12
  Top 0.305: 35.18,35.98 C22.1
  Top 0.406: U$3.2 33.4,38.1 34.16,38.1 35.08,37.19 C22.1
  Top 0.61: C22.1 35.08,29.38 U$5.2
N$13
  Top 0.254: U$1.9 16.39,28.98 16.29,29.08 16.29,30.04 16.45,30.19 17.04,30.19 U$1.11
  Top 0.305: U$1.9 18.24,28.98 C10.1
N$14  (via drill 0.36)  (2 unrouted)
  Top 0.254: U$3.13 27.46,39.5 25.98,39.5
  Bottom 0.254: v25.97,39.5 25.97,36.51 26.61,35.88 v28.19,35.88
N$15  (via drill 0.36)  (1 unrouted)
  Top 0.254: U$1.6 v10.5,30.28 v10.49,30.27
  Bottom 0.254: v16.76,27.18 12,27.18 11.68,27.5 11.68,29.08 v10.49,30.27
N$16
  Top 0.813: C11.2 R14.2
N$17  (via drill 0.36)
  Top 0.254: U$1.7 10.32,29.63 v9.86,29.64 | R12.1 v12.95,24.56 R15.2
  Bottom 0.254: v9.86,29.64 9.86,29.32 11.05,28.13 11.05,25.35 11.92,24.56 v12.95,24.56
N$18  (via drill 0.36)  (1 unrouted)
  Top 0.254: U$3.12 27.59,40.16 v26.64,40.16
  Bottom 0.254: v26.64,40.16 26.92,39.69 26.92,37.47 27.24,37.15 30.1,37.15 31.37,35.88 v33.27,35.88
N$19  (via drill 0.36)
  Top 0.254: v35.05,40.01 33.44,40.01 U$3.5 | C16.1 33.66,45.36 v33.66,44.45 33.59,44.39 R17.2
  Bottom 0.254: v35.05,40.01 35.69,40.64 35.69,44.2 35.43,44.45 v33.66,44.45
N$20
  Top 0.254: U$3.11 28.52,40.72 28.77,40.96 28.77,41.72 28.48,42.01 27.84,42.01 U$3.9 26.75,42.02 C18.1
N$21  (via drill 0.36)  (3 unrouted)
  Top 0.254: U$1.4 10.69,31.58 v10.41,31.54
  Bottom 0.254: v10.41,31.54 6.05,31.54
N$22  (via drill 0.36)  (1 unrouted)
  Top 0.254: U$3.6 34.34,40.72 v34.42,40.64
  Bottom 0.254: v28.32,43.43 31.62,43.43 32,43.05 32,41.27 32.64,40.64 v34.42,40.64
N$23
  Top 0.813: C19.2 R18.2
N$24  (via drill 0.36)  (1 unrouted)
  Top 0.254: U$3.7 35.27,41.37 35.56,41.66 36.83,41.66 v37.08,41.91
  Bottom 0.254: v37.08,41.91 38.61,41.91
N$25
  Top 0.406: U2.8 36.83,58.68 R25.1
  Top 2.54: Q1.2 37.59,57.78 36.96,57.15 R25.1
N$26  (1 unrouted)
N$27
  Top 0.406: U2.2 35.56,68.03 C23.1
N$28  (via drill 0.36)  (1 unrouted)
  Top 0.254: U2.6 v34.29,59.31 | v30.73,59.18 27.43,62.48 27.43,71.88 26.92,72.39 7.62,72.39
  Bottom 0.254: v34.29,59.31 33.91,58.93 30.99,58.93 v30.73,59.18
N$29
  Top 0.406: U2.4 31.38,65.96 R23.1
N$30  (1 unrouted)
N$31  (1 unrouted)
N$32
  Top 0.406: U2.7 35.56,62.23 35.94,62.61 38.57,62.61 C24.1
N$33
  Top 0.254: 50%.C R22.1
N$34
  Top 0.254: 75%.C R21.1
N$35
  Top 0.254: 100%.C R24.1
RST  (3 unrouted)
RX0BF  (1 unrouted)
RX1BF  (1 unrouted)
RX_CAN
  Top 0.305: U6.4 46.48,22.73 46.99,22.23 50.55,22.23 51.05,22.73 51.05,25.78 52.2,26.92 52.2,27.81 51.94,28.07 51.32,28.07 IC1.2
RXINT  (1 unrouted)
SCL  (3 unrouted)
  Top 0.254: U1.12 19.76,68.89 17.27,71.37 7.49,71.37 7.37,71.25
SDA  (3 unrouted)
  Top 0.254: U1.13 19.1,68.66 16.89,70.87 7.37,70.87
SMBALERT  (1 unrouted)
  Top 0.254: U1.16 17.14,69.72 16.51,70.36 7.37,70.36
STE  (1 unrouted)
TEST  (1 unrouted)
TRIGGER_CONVERT  (via drill 0.36)  (1 unrouted)
  Top 0.305: U1.3 18.47,59.64 v18.54,59.56
  Bottom 0.254: 4.45,51.18 15.49,51.18 15.62,51.31 15.62,57.78 17.4,59.56 17.65,59.56
  Bottom 0.305: v18.54,59.56 17.65,59.56
TX0RTS  (1 unrouted)
  Top 0.254: IC1.4 52.41,29.38 53.59,28.19 53.59,25.53
TX1RTS  (1 unrouted)
  Top 0.254: IC1.5 52.52,30.03 54.1,28.45 54.1,25.53
TX2RTS  (1 unrouted)
  Top 0.254: IC1.7 52.11,31.33 54.74,28.7 54.74,25.53
TX_CAN
  Top 0.305: U6.1 50.29,27.05 50.67,27.43 IC1.1
UART_RX  (1 unrouted)
UART_TX  (1 unrouted)
VBUS  (1 unrouted)
  Top 0.254: U$6.1 41.02,39.87 42.29,38.61
  pour Top (no thermals): 38.73,56.26 43.43,56.26 43.43,44.7 38.73,44.7
  pour Bottom (no thermals): 38.73,56.26 43.43,56.26 43.43,44.7 38.73,44.7
VBUS_BYPASS  (via drill 0.36)  (1 unrouted)
  Top 0.254: 39.37,41.4 38.23,42.55 38.23,51.18 37.59,51.82 34.42,51.82 33.02,53.21 U2.5 v33.02,62.48
  Bottom 0.406: Q1.1 33.73,60.33 U2.5 v33.02,62.48
VBUS_ENABLE  (1 unrouted)
  Top 0.254: R23.2 29.4,72.07 27.94,73.53 7.62,73.53
  Top 0.406: C25.1 29.4,67.97 R23.2 29.46,65.98
VCC  (via drill 0.36)  (5 unrouted)
  Top 0.254: U$3.14 24.9,38.77 | U$3.10 26.57,41.37 v26.23,41.02
  Top 0.305: U$1.10 18.26,29.63 v18.67,30.04 | U$1.14 20.23,32.23 v20.26,32.26 | U1.2 17.8,59.99 17.78,59.99 17.78,55.75 R1.2 | 31.88,58.03 31.88,57.02 30.61,55.75 R25.2
  Top 0.406: C26.1 36.83,69.81 U2.1 36.83,63.88 36.45,63.5 32.38,63.5 31.88,62.99 31.88,58.03
  Top 1.422: 22.35,38.73 22.38,38.77 v24.77,38.77 24.9,38.77 | 22.35,38.73 22.35,32.26 v20.26,32.26 | 22.35,38.73 22.35,53.47
  Bottom 0.254: v26.23,41.02 26.23,40.99 24.83,39.59 24.83,38.92 v24.73,38.83
  Bottom 0.305: v18.67,30.04 20.26,31.62 v20.26,32.26
  Bottom 1.422: v24.77,38.77 22.51,38.77 | 22.35,53.34 22.35,32.26 20.32,32.26
  other vias: 23.62,57.91 23.62,56.77 23.62,55.75 23.62,54.74 23.62,53.72 25.27,57.91 25.27,56.77 25.27,55.75 25.27,54.74 25.27,53.72
  pour Top (no thermals): 20.7,58.67 28.45,58.67 28.45,52.83 20.7,52.83
  pour Bottom (no thermals): 20.7,58.67 28.45,58.67 28.45,52.83 20.7,52.83
VCC_1  (via drill 0.36)
  Top 0.305: U1.1 17.14,60.07 12.7,55.63 12.12,55.63 R1.1
  other vias: 10.29,57.91 10.29,56.9 10.29,55.88 10.29,54.86 10.29,53.85 14.22,57.78 14.22,56.77 14.22,55.75 14.22,54.74 14.22,53.72
  pour Top (isolate 0.305, no thermals): 10.67,63.63 13.46,63.63 14.86,62.23 14.86,52.32 14.48,51.94 9.53,51.94 9.02,52.45 9.02,61.98
  pour Bottom (isolate 0.305, no thermals): 10.67,63.63 13.46,63.63 14.86,62.23 14.86,52.32 14.48,51.94 9.53,51.94 9.02,52.45 9.02,61.98
VCORE  (1 unrouted)
  Top 0.305: U5.32 57.71,3.5 57.78,3.43
XIN
  Top 0.254: IC1.9 52.69,32.63 54.99,34.92 Q2.2 C7.1
XOUT
  Top 0.254: IC1.8 52.73,31.98 54.99,29.72 57.01,29.72 Q2.1 C8.1